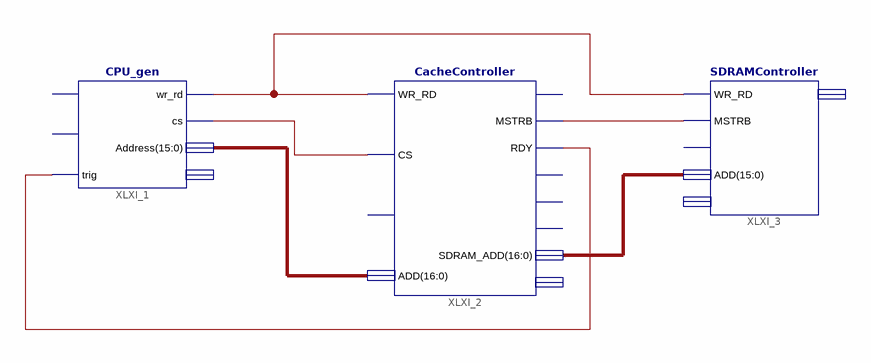
[diagram p0: schematic sheet 1]
// Xilinx ISE schematic trial.sch (spartan3e) as structural Verilog: 3 symbols, 0 ports
module trial (
);

  wire XLXN_3, XLXN_4, XLXN_5, XLXN_6;
  wire [15:0] XLXN_2;
  wire [16:0] XLXN_7;

  CPU_gen XLXI_1 (.trig(XLXN_5), .wr_rd(XLXN_4), .cs(XLXN_3), .Address(XLXN_2));  // open: clk, rst, DOut
  CacheController XLXI_2 (
    .WR_RD(XLXN_4), .CS(XLXN_3), .ADD(XLXN_2), .MSTRB(XLXN_6), .RDY(XLXN_5), .SDRAM_ADD(XLXN_7));  // open: Clk, WEN_SDRAM, WEN_CACHE, CACHE_DOUT_EN, CACHE_DIN_EN, CACHE_ADD
  SDRAMController XLXI_3 (.WR_RD(XLXN_4), .MSTRB(XLXN_6), .ADD(XLXN_7));  // open: Clk, DIN, DOUT
endmodule
